# Altium project AMPM_GT1022.PrjPCB
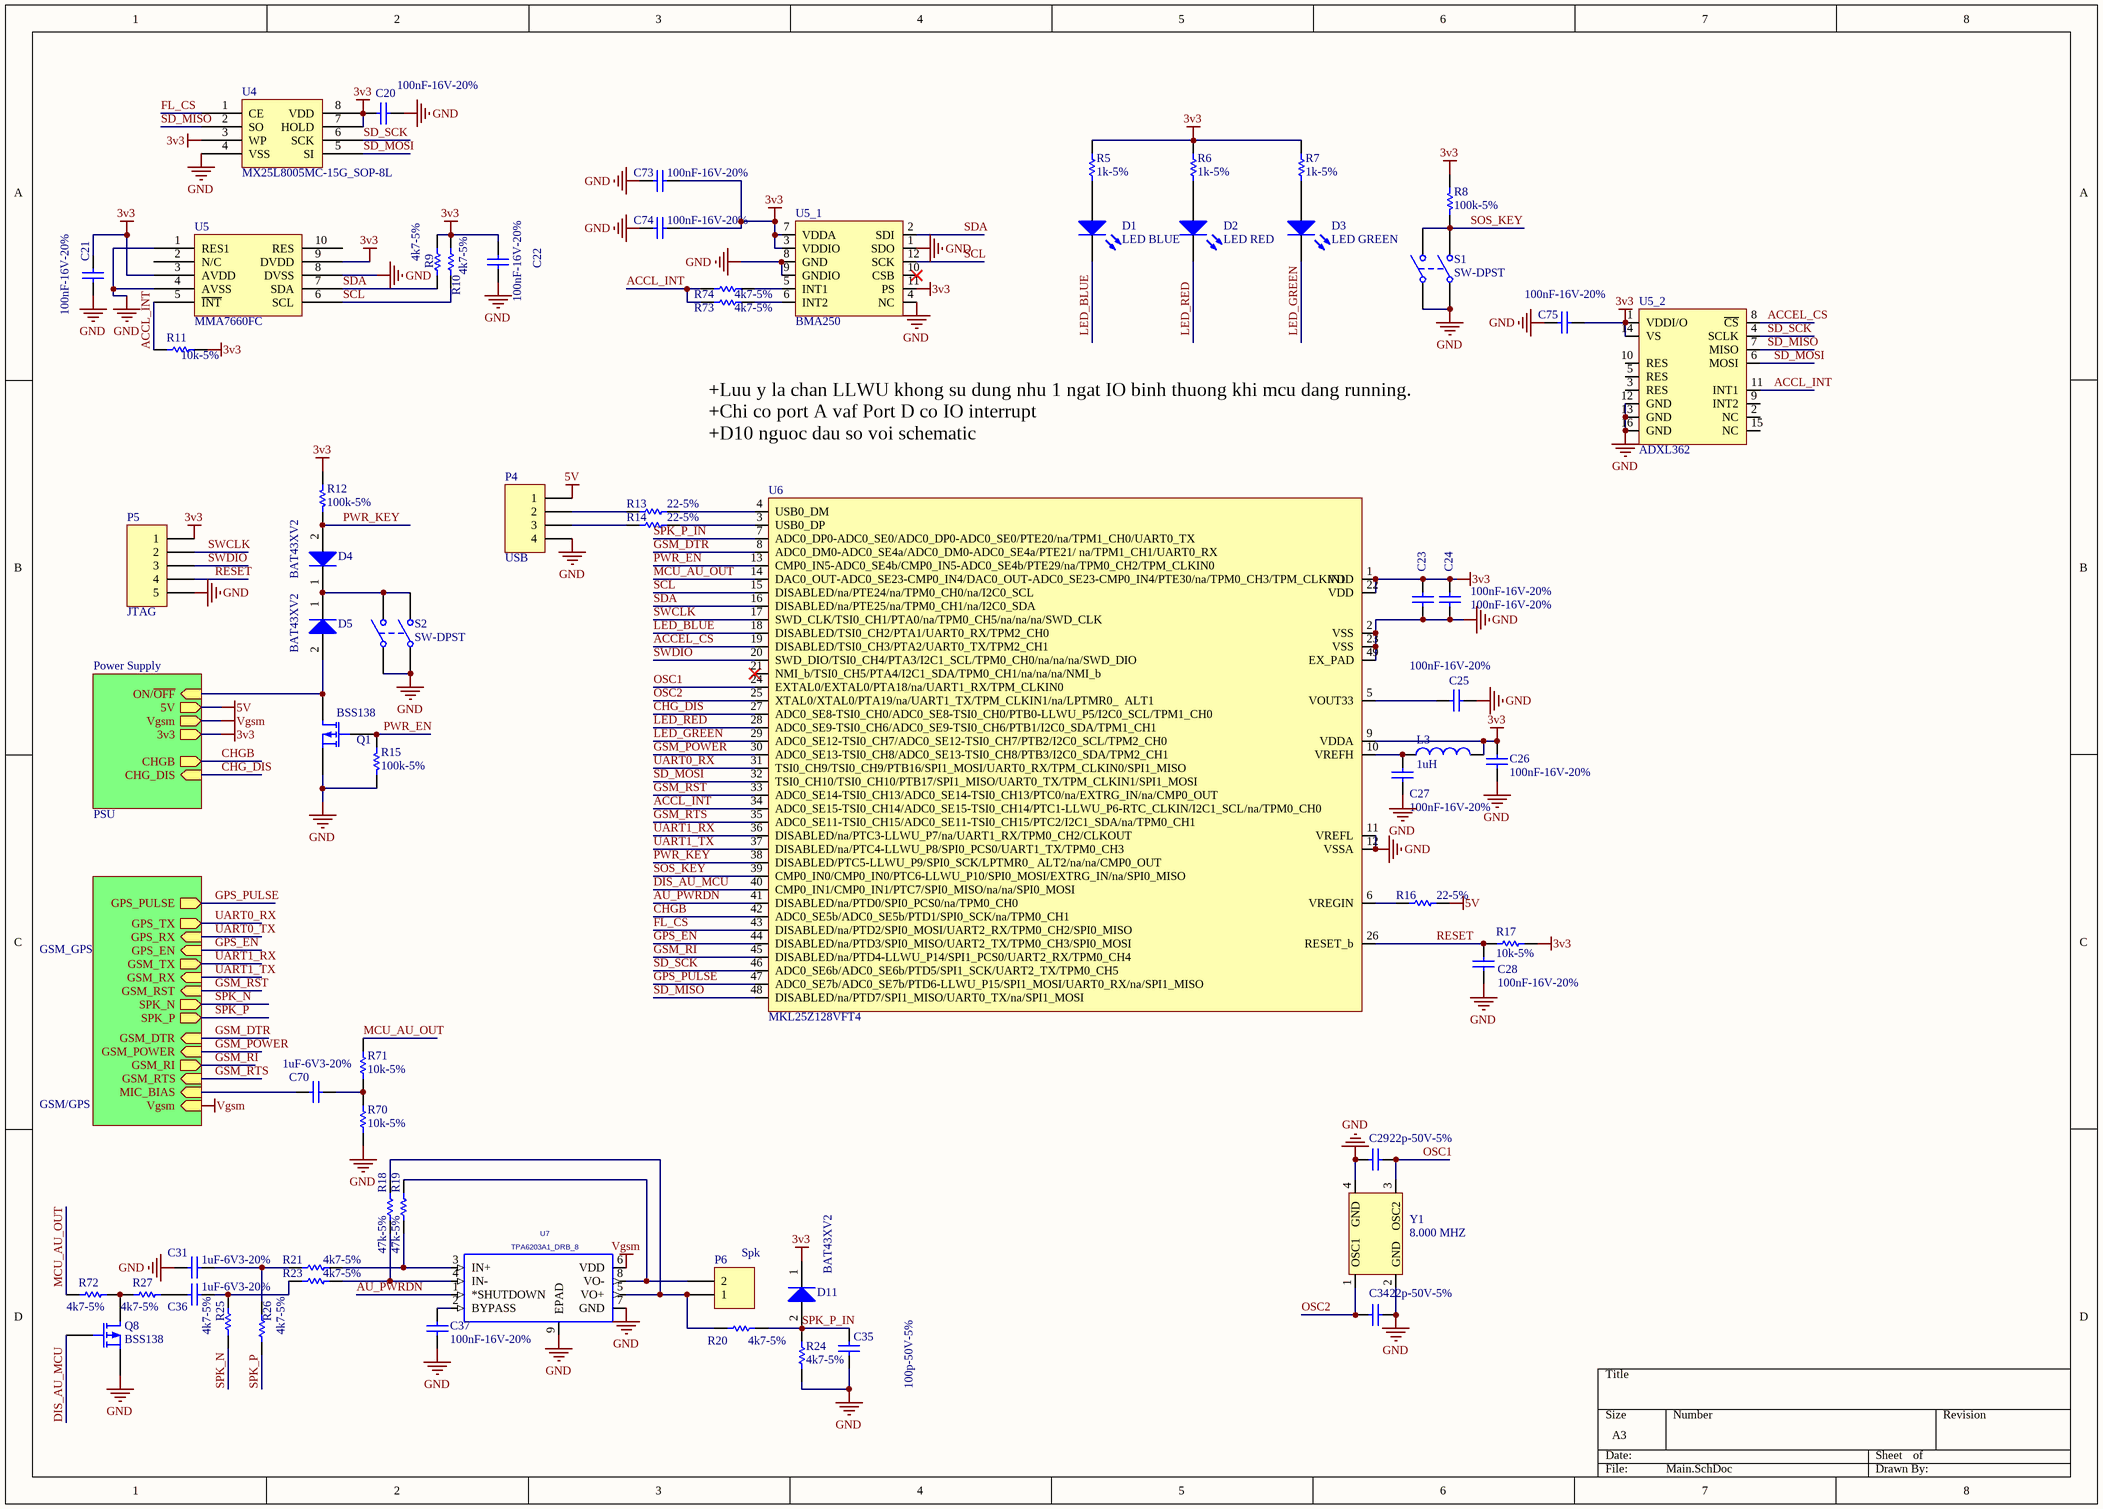
[diagram p0: Main.SchDoc]
3 sheets, 114 parts. Net scope: hierarchical (ports join the sheet entries above them; power ports are global).
Board file: GT1022_V3.PcbDoc
Sheets:
  Main.SchDoc
    Power Supply = PSU.SchDoc
    GSM/GPS = GSM_GPS.SchDoc

## Sheet Main.SchDoc
size A3

### Parts
C20  100nF-16V-20%  [C0402]
C21  100nF-16V-20%  [C0402]
C22  100nF-16V-20%  [C0402]
C23  100nF-16V-20%  [C0402]
C24  100nF-16V-20%  [C0402]
C25  100nF-16V-20%  [C0402]
C26  100nF-16V-20%  [C0402]
C27  100nF-16V-20%  [C0402]
C28  100nF-16V-20%  [C0402]
C29  22p-50V-5%  [C0402]
C31  1uF-6V3-20%  [C0402]
C34  22p-50V-5%  [C0402]
C35  100p-50V-5%  [C0402]
C36  1uF-6V3-20%  [C0402]
C37  100nF-16V-20%  [C0402]
C70  1uF-6V3-20%  [C0402]
C73  100nF-16V-20%  [C0402]
C74  100nF-16V-20%  [C0402]
C75  100nF-16V-20%  [C0402]
D1  LED BLUE  [LED0603-G]
D2  LED RED  [LED0603-G]
D3  LED GREEN  [LED0603-G]
D4  BAT43XV2  [SOD-523F]
D5  BAT43XV2  [SOD-523F]
D11  BAT43XV2  [SOD-523F]
L3  1uH  [L0603]
P4  USB  [GT102x_Housing_USB_nnector]
P5  JTAG  [HEADER_1.27mm_5PIN]
P6  Spk  [SPEAKER-S12A28]
Q1  BSS138  [SOT23-3]
Q8  BSS138  [SOT23-3]
R5  1k-5%  [R0402]
R6  1k-5%  [R0402]
R7  1k-5%  [R0402]
R8  100k-5%  [R0402]
R9  4k7-5%  [R0402]
R10  4k7-5%  [R0402]
R11  10k-5%  [R0402]
R12  100k-5%  [R0402]
R13  22-5%  [R0402]
R14  22-5%  [R0402]
R15  100k-5%  [R0402]
R16  22-5%  [R0402]
R17  10k-5%  [R0402]
R18  47k-5%  [R0402]
R19  47k-5%  [R0402]
R20  4k7-5%  [R0402]
R21  4k7-5%  [R0402]
R23  4k7-5%  [R0402]
R24  4k7-5%  [R0402]
R25  4k7-5%  [R0402]
R26  4k7-5%  [R0402]
R27  4k7-5%  [R0402]
R70  10k-5%  [R0402]
R71  10k-5%  [R0402]
R72  4k7-5%  [R0402]
R73  4k7-5%  [R0402]
R74  4k7-5%  [R0402]
S1  SW-DPST  [BUTTON-TVAF11-025B-R]
S2  SW-DPST  [BUTTON-TVAF11-025B-R]
U4  MX25L8005MC-15G_SOP-8L  [SO8-150mil]
U5  MMA7660FC  [MMA7660FC]
U5_1  BMA250  [BMA250]
U5_2  ADXL362  [ADXL362]
U6  MKL25Z128VFT4
U7  TPA6203A1_DRB_8  [DRB8_1P75X1P5]
Y1  8.000 MHZ  [SMD CRYSTAL 4 x 2.5]

### Sub-sheets
GSM/GPS = GSM_GPS: GSM_POWER (in), GSM_RX (in), GSM_TX (out), Vgsm (in), GPS_RX (in), GPS_TX (out), GSM_RI (out), GPS_EN (in), GSM_RST (in), GSM_RTS (in), SPK_N (out), SPK_P (out), MIC_BIAS (in), GPS_PULSE (out), GSM_DTR (in)
Power Supply = PSU: Vgsm (out), 3v3 (out), 5V (out), ON/~{OFF} (in), CHGB (out), CHG_DIS (in)

### Nets
3v3: C20.1 C21.2 C22.2 C23.1 C24.1 C26.2 C73.2 C74.2 C75.2 D11.1(K) L3.2 P5.1 R5.2 R6.2 R7.2 R8.1 R9.2 R10.2 R11.2 R12.1 R17.2 U4.3(WP) U4.7(HOLD) U4.8(VDD) U5.3(AVDD) U5.9(DVDD) U5_1.3(VDDIO) U5_1.7(VDDA) U5_1.11(PS) U5_2.1(VDDI/O) U5_2.14(VS) U6.1(VDD) U6.9(VDDA) U6.22(VDD) ; sheet Power Supply/3v3
5V: P4.1 R16.2 ; sheet Power Supply/5V
GND: C20.2 C21.1 C22.1 C23.2 C24.2 C25.2 C26.1 C27.1 C28.1 C29.1 C31.2 C34.2 C35.1 C37.1 C73.1 C74.1 C75.1 P4.4 P5.5 Q1.2(S) Q8.2(S) R15.2 R24.2 R70.1 S1.1 S1.2 S2.1 S2.2 U4.4(VSS) U5.1(RES1) U5.4(AVSS) U5.8(DVSS) U5_1.1(SDO) U5_1.4(NC) U5_1.8(GND) U5_1.9(GNDIO) U5_2.12(GND) U5_2.13(GND) U5_2.16(GND) U6.2(VSS) U6.11(VREFL) U6.12(VSSA) U6.23(VSS) U6.49(EX_PAD) U7.7(GND) U7.9(EPAD) Y1.2(GND) Y1.4(GND)
VGSM: U7.6(VDD) ; sheet Power Supply/Vgsm, sheet GSM/GPS/Vgsm
ACCEL_CS: U5_2.8(~{CS}) U6.19(DISABLED/TSI0_CH3/PTA2/UART0_TX/TPM2_CH1)
ACCL_INT: R11.1 R73.2 R74.2 U5.5(~{INT}) U5_2.11(INT1) U6.34(ADC0_SE15-TSI0_CH14/ADC0_SE15-TSI0_CH14/PTC1-LLWU_P6-RTC_CLKIN/I2C1_SCL/na/TPM0_CH0)
AU_PWRDN: U6.41(DISABLED/na/PTD0/SPI0_PCS0/na/TPM0_CH0) U7.1(*SHUTDOWN)
CHG_DIS: U6.27(ADC0_SE8-TSI0_CH0/ADC0_SE8-TSI0_CH0/PTB0-LLWU_P5/I2C0_SCL/TPM1_CH0) ; sheet Power Supply/CHG_DIS
CHGB: U6.42(ADC0_SE5b/ADC0_SE5b/PTD1/SPI0_SCK/na/TPM0_CH1) ; sheet Power Supply/CHGB
DIS_AU_MCU: Q8.1(G) U6.40(CMP0_IN1/CMP0_IN1/PTC7/SPI0_MISO/na/na/SPI0_MOSI)
FL_CS: U4.1(CE) U6.43(DISABLED/na/PTD2/SPI0_MOSI/UART2_RX/TPM0_CH2/SPI0_MISO)
GPS_EN: U6.44(DISABLED/na/PTD3/SPI0_MISO/UART2_TX/TPM0_CH3/SPI0_MOSI) ; sheet GSM/GPS/GPS_EN
GPS_PULSE: U6.47(ADC0_SE7b/ADC0_SE7b/PTD6-LLWU_P15/SPI1_MOSI/UART0_RX/na/SPI1_MISO) ; sheet GSM/GPS/GPS_PULSE
GSM_DTR: U6.8(ADC0_DM0-ADC0_SE4a/ADC0_DM0-ADC0_SE4a/PTE21/_na/TPM1_CH1/UART0_RX) ; sheet GSM/GPS/GSM_DTR
GSM_POWER: U6.30(ADC0_SE13-TSI0_CH8/ADC0_SE13-TSI0_CH8/PTB3/I2C0_SDA/TPM2_CH1) ; sheet GSM/GPS/GSM_POWER
GSM_RI: U6.45(DISABLED/na/PTD4-LLWU_P14/SPI1_PCS0/UART2_RX/TPM0_CH4) ; sheet GSM/GPS/GSM_RI
GSM_RST: U6.33(ADC0_SE14-TSI0_CH13/ADC0_SE14-TSI0_CH13/PTC0/na/EXTRG_IN/na/CMP0_OUT) ; sheet GSM/GPS/GSM_RST
GSM_RTS: U6.35(ADC0_SE11-TSI0_CH15/ADC0_SE11-TSI0_CH15/PTC2/I2C1_SDA/na/TPM0_CH1) ; sheet GSM/GPS/GSM_RTS
LED_BLUE: D1.2(K) U6.18(DISABLED/TSI0_CH2/PTA1/UART0_RX/TPM2_CH0)
LED_GREEN: D3.2(K) U6.29(ADC0_SE12-TSI0_CH7/ADC0_SE12-TSI0_CH7/PTB2/I2C0_SCL/TPM2_CH0)
LED_RED: D2.2(K) U6.28(ADC0_SE9-TSI0_CH6/ADC0_SE9-TSI0_CH6/PTB1/I2C0_SDA/TPM1_CH1)
MCU_AU_OUT: R71.2 R72.1 U6.14(DAC0_OUT-ADC0_SE23-CMP0_IN4/DAC0_OUT-ADC0_SE23-CMP0_IN4/PTE30/na/TPM0_CH3/TPM_CLKIN1)
MIC_BIAS: C70.2 ; sheet GSM/GPS/MIC_BIAS
OSC1: C29.2 U6.24(EXTAL0/EXTAL0/PTA18/na/UART1_RX/TPM_CLKIN0) Y1.3(OSC2)
OSC2: C34.1 U6.25(XTAL0/XTAL0/PTA19/na/UART1_TX/TPM_CLKIN1/na/LPTMR0___ALT1) Y1.1(OSC1)
PWR_EN: Q1.1(G) R15.1 U6.13(CMP0_IN5-ADC0_SE4b/CMP0_IN5-ADC0_SE4b/PTE29/na/TPM0_CH2/TPM_CLKIN0)
PWR_KEY: D4.2(A) R12.2 U6.38(DISABLED/PTC5-LLWU_P9/SPI0_SCK/LPTMR0__ALT2/na/na/CMP0_OUT)
RESET: C28.2 P5.4 R17.1 U6.26(RESET_b)
SCL: R10.1 U5.6(SCL) U5_1.12(SCK) U6.15(DISABLED/na/PTE24/na/TPM0_CH0/na/I2C0_SCL)
SD_MISO: U4.2(SO) U5_2.7(MISO) U6.48(DISABLED/na/PTD7/SPI1_MISO/UART0_TX/na/SPI1_MOSI)
SD_MOSI: U4.5(SI) U5_2.6(MOSI) U6.32(TSI0_CH10/TSI0_CH10/PTB17/SPI1_MISO/UART0_TX/TPM_CLKIN1/SPI1_MOSI)
SD_SCK: U4.6(SCK) U5_2.4(SCLK) U6.46(ADC0_SE6b/ADC0_SE6b/PTD5/SPI1_SCK/UART2_TX/TPM0_CH5)
SDA: R9.1 U5.7(SDA) U5_1.2(SDI) U6.16(DISABLED/na/PTE25/na/TPM0_CH1/na/I2C0_SDA)
SOS_KEY: R8.2 S1.3 S1.4 U6.39(CMP0_IN0/CMP0_IN0/PTC6-LLWU_P10/SPI0_MOSI/EXTRG_IN/na/SPI0_MISO)
SPK_N: R25.2 ; sheet GSM/GPS/SPK_N
SPK_P: R26.2 ; sheet GSM/GPS/SPK_P
SPK_P_IN: C35.2 D11.2(A) R20.1 R24.1 U6.7(ADC0_DP0-ADC0_SE0/ADC0_DP0-ADC0_SE0/PTE20/na/TPM1_CH0/UART0_TX)
SWCLK: P5.2 U6.17(SWD_CLK/TSI0_CH1/PTA0/na/TPM0_CH5/na/na/na/SWD_CLK)
SWDIO: P5.3 U6.20(SWD_DIO/TSI0_CH4/PTA3/I2C1_SCL/TPM0_CH0/na/na/na/SWD_DIO)
UART0_RX: U6.31(TSI0_CH9/TSI0_CH9/PTB16/SPI1_MOSI/UART0_RX/TPM_CLKIN0/SPI1_MISO) ; sheet GSM/GPS/GPS_TX  [project net GPS_TXD]
UART1_RX: U6.36(DISABLED/na/PTC3-LLWU_P7/na/UART1_RX/TPM0_CH2/CLKOUT) ; sheet GSM/GPS/GSM_TX
UART1_TX: U6.37(DISABLED/na/PTC4-LLWU_P8/SPI0_PCS0/UART1_TX/TPM0_CH3) ; sheet GSM/GPS/GSM_RX
NetC25_1: C25.1 U6.5(VOUT33)
NetC27_2: C27.2 L3.1 U6.10(VREFH)
NetC31_1: C31.1 R21.2 R26.1
NetC36_1: C36.1 R23.2 R25.1
NetC36_2: C36.2 R27.2
NetC37_2: C37.2 U7.2(BYPASS)
NetC70_1: C70.1 R70.2 R71.1
NetD1_1: D1.1(A) R5.1
NetD2_1: D2.1(A) R6.1
NetD3_1: D3.1(A) R7.1
NetD4_1: D4.1(K) D5.1(K) S2.3 S2.4
NetD5_2: D5.2(A) Q1.3(D) ; sheet Power Supply/ON/~{OFF}
NetP4_2: P4.2 R13.1
NetP4_3: P4.3 R14.1
NetP6_1: P6.1 R18.1 R20.2 U7.5(VO+)
NetP6_2: P6.2 R19.1 U7.8(VO-)
NetQ8_3: Q8.3(D) R27.1 R72.2
NetR13_2: R13.2 U6.4(USB0_DM)
NetR14_2: R14.2 U6.3(USB0_DP)
NetR16_1: R16.1 U6.6(VREGIN)
NetR18_2: R18.2 R23.1 U7.4(IN-)
NetR19_2: R19.2 R21.1 U7.3(IN+)
NetR73_1: R73.1 U5_1.6(INT2)
NetR74_1: R74.1 U5_1.5(INT1)

Not connected (* = marked no-connect by the designer): U5 2(N/C) 10(RES); U5_1 10(CSB)*; U5_2 2(NC) 3(RES) 5(RES) 9(INT2) 10(RES) 15(NC); U6 21(NMI_b/TSI0_CH5/PTA4/I2C1_SDA/TPM0_CH1/na/na/na/NMI_b)*

### Notes on the sheet
- +Luu y la chan LLWU khong su dung nhu 1 ngat IO binh thuong khi mcu dang running.
  +Chi co port A vaf Port D co IO interrupt
  +D10 nguoc dau so voi schematic

### Library data of the parts
C20-C28 C37 C73-C75 = Cap: CAP CER 0.1UF 16V Y5V 0402; Manufacturer: Yageo; Manufacturer Part Number: CC0402ZRY5V7BB104; Published: 8-Jun-2000; LatestRevisionDate: 17-Jul-2002; LatestRevisionNote: Re-released for DXP Platform.; PackageReference: C0402; Publisher: Altium Limited; Value: 100nF-16V-20%; Digi-Key Part Number: 311-1047-1-ND; Unit Price: 0.00250
C29 C34 = Cap: CAP CER 22PF 50V 5% NPO 0402; Manufacturer: Yageo; Manufacturer Part Number: CC0402JRNPO9BN220; Description: CAP CER 15PF 50V 5% NPO 0402; Published: 8-Jun-2000; LatestRevisionDate: 17-Jul-2002; LatestRevisionNote: Re-released for DXP Platform.; PackageReference: C0402; Publisher: Altium Limited; Value: 22p-50V-5%; Digi-Key Part Number: 311-1018-2-ND; Unit Price: 0.00270
C31 C36 C70 = Cap: CAP CER 1UF 6.3V Y5V 0402; Manufacturer: Yageo; Manufacturer Part Number: CC0402ZRY5V5BB105; Published: 8-Jun-2000; LatestRevisionDate: 17-Jul-2002; LatestRevisionNote: Re-released for DXP Platform.; PackageReference: C0402; Publisher: Altium Limited; Value: 1uF-6V3-20%; Digi-Key Part Number: 311-1377-2-ND; Unit Price: 0.00465
C35 = Cap: CAP CER 100PF 50V 5% NPO 0402; Manufacturer: Yageo; Manufacturer Part Number: CC0402JRNPO9BN101; Description: CAP CER 47PF 50V 5% NPO 0402; Published: 8-Jun-2000; LatestRevisionDate: 17-Jul-2002; LatestRevisionNote: Re-released for DXP Platform.; PackageReference: C0603; Publisher: Altium Limited; Value: 100p-50V-5%; Digi-Key Part Number: 311-1024-2-ND; Unit Price: 0.00270
D1 = LED2: LED BLUE CLEAR THIN 0603 SMD; Manufacturer: Lite-On Inc; Manufacturer Part Number: LTST-C191KGKT; Published: 8-Jun-2000; LatestRevisionDate: 17-Jul-2002; LatestRevisionNote: Re-released for DXP Platform.; PackageVersion: Feb-2002; PackageReference: 3.2X1.6X1.1; Publisher: Altium Limited; Digi-Key Part Number: 160-1446-2-ND; Unit Price: 0.03780; Value: LED BLUE
D2 = LED2: LED RED CLEAR THIN 0603 SMD; Manufacturer: Lite-On Inc; Manufacturer Part Number: LTST-C191KGKT; Published: 8-Jun-2000; LatestRevisionDate: 17-Jul-2002; LatestRevisionNote: Re-released for DXP Platform.; PackageVersion: Feb-2002; PackageReference: 3.2X1.6X1.1; Publisher: Altium Limited; Digi-Key Part Number: 160-1446-2-ND; Unit Price: 0.03780; Value: LED RED
D3 = LED2: LED GREEN CLEAR THIN 0603 SMD; Manufacturer: Lite-On Inc; Manufacturer Part Number: LTST-C191KGKT; Published: 8-Jun-2000; LatestRevisionDate: 17-Jul-2002; LatestRevisionNote: Re-released for DXP Platform.; PackageVersion: Feb-2002; PackageReference: 3.2X1.6X1.1; Publisher: Altium Limited; Digi-Key Part Number: 160-1446-2-ND; Unit Price: 0.03780; Value: LED GREEN
D4 D5 D11 = Diode: Diode Type SMD; Manufacturer: Fairchild Semiconductor; Published: 8-Jun-2000; LatestRevisionDate: 17-Jul-2002; LatestRevisionNote: Re-released for DXP Platform.; PackageVersion: Sep-1996; PackageReference: SMC; Publisher: Altium Limited; Code_JEDEC: DO-214-AB; Value: BAT43XV2; Digi-Key Part Number: BAT43XV2CT-ND; Manufacturer Part Number: BAT43XV2; Unit Price: 0.01822
L3 = Inductor: INDUCTOR 1.0UH 150MA 0603; Manufacturer: Murata Electronics North America; Manufacturer Part Number: LQM18FN1R0M00D; Code_IEC: 1005; Published: 8-Jun-2000; LatestRevisionDate: 29-May-2009; LatestRevisionNote: IPC-7351 Footprint Added.; PackageReference: 0402-A; Publisher: Altium Limited; PackageDescription: Chip Inductor; Code_JEITA: 0402; Value: 1uH; Digi-Key Part Number: 490-4022-2-ND; Unit Price: 0.03756
P4 = Header 4: Header, 4-Pin; LatestRevisionDate: 17-Jul-2002; LatestRevisionNote: Re-released for DXP Platform.; Publisher: Altium Limited
P5 = Header 5: Header, 5-Pin; LatestRevisionDate: 17-Jul-2002; LatestRevisionNote: Re-released for DXP Platform.; Publisher: Altium Limited
P6 = Header 2: Header, 2-Pin; LatestRevisionDate: 17-Jul-2002; LatestRevisionNote: Re-released for DXP Platform.; Publisher: Altium Limited
Q1 Q8 = MOSFET-P: MOSFET N-CH 50V 200MA SOT23-3; Manufacturer: Diodes Inc; Manufacturer Part Number: BSS138-7-F; Published: 8-Jun-2000; LatestRevisionDate: 17-Jul-2002; LatestRevisionNote: Re-released for DXP Platform.; PackageVersion: 1995/1996; PackageReference: E3; Publisher: Altium Limited; Digi-Key Part Number: BSS138-FDICT-ND; Unit Price: 0.06575
R5-R7 = Res1: RES 1.0K OHM 1/16W 5% 0402 SMD; Manufacturer: Yageo; Manufacturer Part Number: RC0402JR-071KL; Published: 8-Jun-2000; LatestRevisionDate: 17-Jul-2002; LatestRevisionNote: Re-released for DXP Platform.; PackageReference: R0603; Publisher: Altium Limited; Value: 1k-5%; Digi-Key Part Number: 311-1.0KJRCT-ND; Unit Price: 0.00178
R8 R12 R15 = Res1: RES 100K OHM 1/16W 5% 0402 SMD; Manufacturer: Yageo; Manufacturer Part Number: RC0402JR-07100KL; Published: 8-Jun-2000; LatestRevisionDate: 17-Jul-2002; LatestRevisionNote: Re-released for DXP Platform.; PackageReference: R0402; Publisher: Altium Limited; Value: 100k-5%; Digi-Key Part Number: 311-100KJRCT-ND; Unit Price: 0.00171
R9 R10 R20 R21 R23-R27 R72-R74 = Res1: RES 4.7K OHM 1/16W 5% 0402 SMD; Manufacturer: Yageo; Manufacturer Part Number: RC0402JR-074K7L; Description: RES 10K OHM 1/10W 5% 0603 SMD; Published: 8-Jun-2000; LatestRevisionDate: 17-Jul-2002; LatestRevisionNote: Re-released for DXP Platform.; PackageReference: R0603; Publisher: Altium Limited; Value: 4k7-5%; Digi-Key Part Number: 311-4.7KJRCT-ND; Unit Price: 0.00178
R11 R17 R70 R71 = Res1: RES 10K OHM 1/16W 5% 0402 SMD; Manufacturer: Yageo; Manufacturer Part Number: RC0402JR-0710KL; Description: RES 10K OHM 1/10W 5% 0603 SMD; Published: 8-Jun-2000; LatestRevisionDate: 17-Jul-2002; LatestRevisionNote: Re-released for DXP Platform.; PackageReference: R0603; Publisher: Altium Limited; Value: 10k-5%; Digi-Key Part Number: 311-10KJRCT-ND; Unit Price: 0.00178
R13 R14 R16 = Res1: RES 22 OHM 1/16W 5% 0402 SMD; Manufacturer: Yageo; Manufacturer Part Number: RC0402JR-0722RL; Published: 8-Jun-2000; LatestRevisionDate: 17-Jul-2002; LatestRevisionNote: Re-released for DXP Platform.; PackageReference: R0402; Publisher: Altium Limited; Value: 22-5%; Digi-Key Part Number: 311-22JRCT-ND; Unit Price: 0.00178
R18 R19 = Res1: RES 47K OHM 1/16W 5% 0402 SMD; Manufacturer: Yageo; Manufacturer Part Number: RC0402JR-0747KL; Published: 8-Jun-2000; LatestRevisionDate: 17-Jul-2002; LatestRevisionNote: Re-released for DXP Platform.; PackageReference: R0603; Publisher: Altium Limited; Value: 47k-5%; Digi-Key Part Number: 311-47KJRCT-ND; Unit Price: 0.00178
S1 S2 = SW-DPST: Double-Pole, Single-Throw Switch; Published: 24-Mar-1999; LatestRevisionDate: 17-Jul-2002; LatestRevisionNote: Re-released for DXP Platform.; PackageReference: DPST-4; Publisher: Altium Limited
U4 = FlashIC: Manufacturer: Tyrone
U5 = MMA7660FC: ACCELEROMETER 3X3 DGTL 10-DFN; Manufacturer: Freescale Semiconductor; Manufacturer Part Number: MMA7660FCT; Unit Price: 0.67000; Digi-Key Part Number: MMA7660FCT-ND
U5_1 = BMA250: 3-AXIS ACCELEROMETER DIGITAL I/F
U5_2 = ADCL362: IC ACCEL DIG LO PWR 3AX 16LGA; Manufacturer Part Number: ADXL362BCCZ-RL7; Manufacturer: Analog Devices Inc; Digi-Key Part Number: ADXL362BCCZ-R2CT-ND; Unit Price: 4.76400; Value: ADXL362
U6 = MKL25Z128VFT4: IC ARM CORTEX MCU 128KB 48QFN; Manufacturer: Freescale Semiconductor; Digi-Key Part Number: MKL25Z128VFT4-ND; Manufacturer Part Number: MKL25Z128VFT4; Unit Price: 2.14920
U7 = TPA6203A1_DRB_8: IC AMP AUDIO PWR 1.25W MONO 8SON; Manufacturer Part Number: TPA6203A1DRB; Vendor: Texas Instruments; PACKAGE_DESIGNATOR: DRB; PIN_COUNT: 8; FAMILY_NAME: DYNAMIC SPEAKER; INDUSTRY_STD_PKG_TYPE: SON; Value: TPA6203A1_DRB_8; GENERIC_PART_NUMBER: TPA6203A1; Datasheet URL: http://www.ti.com/lit/gpn/TPA6203A1; Manufacturer: Texas Instruments; Digi-Key Part Number: 296-34561-5-ND; Unit Price: 0.37248
Y1 = CRYSTAL-SMT: CRYSTAL 8.000 MHZ 18PF SMD; Manufacturer: TXC CORPORATION; Manufacturer Part Number: 7B-8.000MAAJ-T; Digi-Key Part Number: 887-1452-2-ND; Unit Price: 0.39000; Value: 8.000 MHZ

## Sheet PSU.SchDoc
size A4
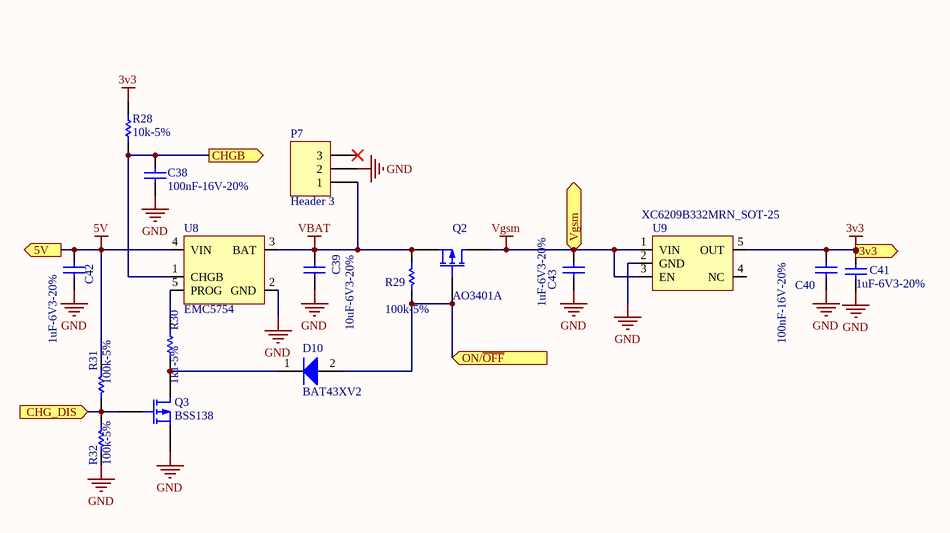
[diagram p1: PSU.SchDoc]

### Parts
C38  100nF-16V-20%  [C0402]
C39  10uF-6V3-20%  [C0402]
C40  100nF-16V-20%  [C0402]
C41  1uF-6V3-20%  [C0402]
C42  1uF-6V3-20%  [C0402]
C43  1uF-6V3-20%  [C0402]
D10  BAT43XV2  [SOD-523F]
P7  Header 3  [BAT_CON]
Q2  AO3401A  [SOT23-3]
Q3  BSS138  [SOT23-3]
R28  10k-5%  [R0402]
R29  100k-5%  [R0402]
R30  1k1-5%  [R0402]
R31  100k-5%  [R0402]
R32  100k-5%  [R0402]
U8  EMC5754  [SOT23-5]
U9  XC6209B332MRN_SOT-25  [SOT23-5]

### Ports
3v3 (out), 5V (out), CHG_DIS (in), CHGB (out), ON/~{OFF} (in), Vgsm (out)

### Nets
3v3: C40.2 C41.1 R28.2 U9.5(OUT) ; port 3v3
5V: C42.2 R31.2 U8.4(VIN) ; port 5V
GND: C38.1 C39.1 C40.1 C41.2 C42.1 C43.2 P7.2 Q3.2(S) R32.1 U8.2(GND) U9.2(GND)
VBAT: C39.2 P7.1 Q2.2(S) R29.2 U8.3(BAT)
VGSM: C43.1 Q2.3(D) U9.1(VIN) U9.3(EN) ; port Vgsm
CHG_DIS: Q3.1(G) R31.1 R32.2 ; port CHG_DIS
CHGB: C38.2 R28.1 U8.1(CHGB) ; port CHGB
NetD5_2: D10.2(A) Q2.1(G) R29.1 ; port ON/~{OFF}
NetD10_1: D10.1(K) Q3.3(D) R30.2
NetR30_1: R30.1 U8.5(PROG)

Not connected (* = marked no-connect by the designer): P7 3*; U9 4(NC)

### Library data of the parts
C38 C40 = Cap: as C20 on sheet Main; Published: 8-Jun-2000; LatestRevisionDate: 17-Jul-2002; LatestRevisionNote: Re-released for DXP Platform.; PackageReference: C0402; Publisher: Altium Limited; Value: 100nF-16V-20%; Digi-Key Part Number: 311-1047-1-ND; Unit Price: 0.00250
C39 = Cap: CAP CER 10UF 6.3V 20% X5R 0603; Manufacturer: Yageo; Manufacturer Part Number: CC0603MRX5R5BB106; Published: 8-Jun-2000; LatestRevisionDate: 17-Jul-2002; LatestRevisionNote: Re-released for DXP Platform.; PackageReference: C0603; Publisher: Altium Limited; Value: 10uF-6V3-20%; Digi-Key Part Number: 311-1448-1-ND; Unit Price: 0.06176
C41-C43 = Cap: as C31 on sheet Main; Published: 8-Jun-2000; LatestRevisionDate: 17-Jul-2002; LatestRevisionNote: Re-released for DXP Platform.; PackageReference: C0402; Publisher: Altium Limited; Value: 1uF-6V3-20%; Digi-Key Part Number: 311-1377-2-ND; Unit Price: 0.00465
D10 = Diode: as D4 on sheet Main; Published: 8-Jun-2000; LatestRevisionDate: 17-Jul-2002; LatestRevisionNote: Re-released for DXP Platform.; PackageVersion: Sep-1996; PackageReference: SMC; Publisher: Altium Limited; Code_JEDEC: DO-214-AB; Value: BAT43XV2; Digi-Key Part Number: BAT43XV2CT-ND; Manufacturer Part Number: BAT43XV2; Unit Price: 0.01822
P7 = Header 3: Header, 3-Pin; LatestRevisionDate: 17-Jul-2002; LatestRevisionNote: Re-released for DXP Platform.; Publisher: Altium Limited
Q2 = MOSFET-P: MOSFET P-CH -30V -4.3A SOT23; Manufacturer: Alpha & Omega Semiconductor Inc; Remark: NA; Published: 8-Jun-2000; LatestRevisionDate: 17-Jul-2002; LatestRevisionNote: Re-released for DXP Platform.; PackageVersion: 1995/1996; PackageReference: E3; Publisher: Altium Limited; Digi-Key Part Number: 785-1001-1-ND; Manufacturer Part Number: AO3401A; Unit Price: 0.12400
Q3 = MOSFET-P: as Q1 on sheet Main; Published: 8-Jun-2000; LatestRevisionDate: 17-Jul-2002; LatestRevisionNote: Re-released for DXP Platform.; PackageVersion: 1995/1996; PackageReference: E3; Publisher: Altium Limited; Digi-Key Part Number: BSS138-FDICT-ND; Unit Price: 0.06575
R28 = Res1: as R11 on sheet Main; Published: 8-Jun-2000; LatestRevisionDate: 17-Jul-2002; LatestRevisionNote: Re-released for DXP Platform.; PackageReference: R0603; Publisher: Altium Limited; Value: 10k-5%; Digi-Key Part Number: 311-10KJRCT-ND; Unit Price: 0.00178
R29 R31 R32 = Res1: as R8 on sheet Main; Published: 8-Jun-2000; LatestRevisionDate: 17-Jul-2002; LatestRevisionNote: Re-released for DXP Platform.; PackageReference: R0402; Publisher: Altium Limited; Value: 100k-5%; Digi-Key Part Number: 311-100KJRCT-ND; Unit Price: 0.00171
R30 = Res1: RES 1.1K OHM 1/16W 5% 0402 SMD; Manufacturer: Yageo; Manufacturer Part Number: RC0402JR-071K1L; Published: 8-Jun-2000; LatestRevisionDate: 17-Jul-2002; LatestRevisionNote: Re-released for DXP Platform.; PackageReference: R0603; Publisher: Altium Limited; Value: 1k1-5%; Digi-Key Part Number: 311-1.1KJRCT-ND; Unit Price: 0.00207
U9 = XC6209B332MRN_SOT-25: Manufacturer: Tyrone

## Sheet GSM_GPS.SchDoc
size A4
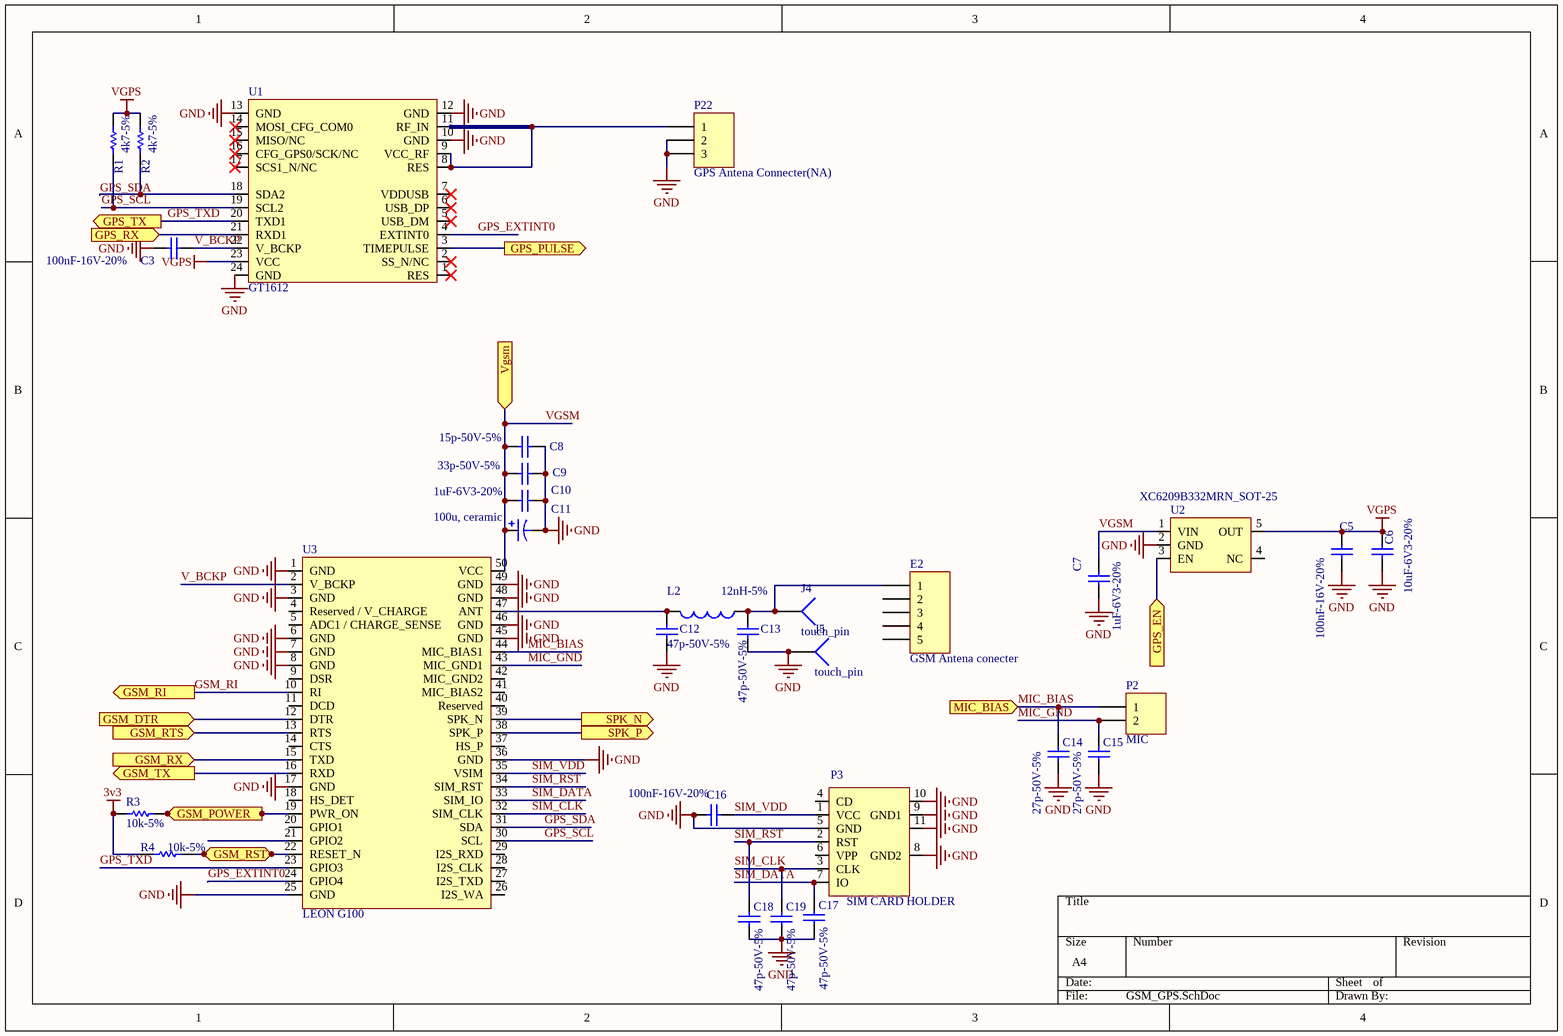
[diagram p2: GSM_GPS.SchDoc]

### Parts
C3  100nF-16V-20%  [C0402]
C5  100nF-16V-20%  [C0402]
C6  10uF-6V3-20%  [C0603]
C7  1uF-6V3-20%  [C0402]
C8  15p-50V-5%  [C0402]
C9  33p-50V-5%  [C0402]
C10  1uF-6V3-20%  [C0402]
C11  100u, ceramic  [C1210]
C12  47p-50V-5%  [C0402]
C13  47p-50V-5%  [C0402]
C14  27p-50V-5%  [C0402]
C15  27p-50V-5%  [C0402]
C16  100nF-16V-20%  [C0402]
C17  47p-50V-5%  [C0402]
C18  47p-50V-5%  [C0402]
C19  47p-50V-5%  [C0402]
E2  GSM Antena conecter  [A10343-GSM850/900/1800/1900/WCDMA]
J4  touch_pin  [TOUCH_PIN]
J5  touch_pin  [TOUCH_PIN]
L2  12nH-5%  [R0402]
P2  MIC  [HEADER_1.27mm_2PIN]
P3  SIM CARD HOLDER  [MICRO_SIM_SOCKET]
P22  GPS Antena Connecter(NA)  [IPX SMD PCB Plug]
R1  4k7-5%  [R0402]
R2  4k7-5%  [R0402]
R3  10k-5%  [R0402]
R4  10k-5%  [R0402]
U1  GT1612  [GT1612]
U2  XC6209B332MRN_SOT-25  [SOT23-5]
U3  LEON G100  [U-BLOX-G100]

### Ports
GPS_EN (in), GPS_PULSE (out), GPS_RX (in), GPS_TX (out), GSM_DTR (in), GSM_POWER (in), GSM_RI (out), GSM_RST (in), GSM_RTS (in), GSM_RX (in), GSM_TX (out), MIC_BIAS (in), SPK_N (out), SPK_P (out), Vgsm (in)

### Nets
3v3: R3.1 R4.1
GND: C3.1 C5.1 C6.1 C7.1 C8.2 C9.2 C10.1 C11.2 C12.1 C13.1 C14.1 C15.1 C16.2 C17.1 C18.1 C19.1 J5.1 P3.5(GND) P3.8(GND2) P3.9(GND1) P3.10(GND3) P3.11(GND4) P22.2 P22.3 U1.10(GND) U1.12(GND) U1.13(GND) U1.24(GND) U2.2(GND) U3.1(GND) U3.3(GND) U3.6(GND) U3.7(GND) U3.8(GND) U3.17(GND) U3.25(GND) U3.36(GND) U3.45(GND) U3.46(GND) U3.48(GND) U3.49(GND)
VGPS: C5.2 C6.2 R1.2 R2.2 U1.23(VCC) U2.5(OUT)
VGSM: C7.2 C8.1 C9.1 C10.2 C11.1 U2.1(VIN) U3.50(VCC) ; port Vgsm
GPS_EN: U2.3(EN) ; port GPS_EN
GPS_EXTINT0: U1.4(EXTINT0) U3.24(GPIO4)
GPS_PULSE: U1.3(TIMEPULSE) ; port GPS_PULSE
GPS_SCL: R1.1 U1.19(SCL2) U3.30(SCL)
GPS_SDA: R2.1 U1.18(SDA2) U3.31(SDA)
GPS_TXD: U1.20(TXD1) U3.23(GPIO3) ; port GPS_TX
GSM_DTR: U3.12(DTR) ; port GSM_DTR
GSM_POWER: R3.2 U3.19(PWR_ON) ; port GSM_POWER
GSM_RI: U3.10(RI) ; port GSM_RI
GSM_RST: R4.2 U3.22(RESET_N) ; port GSM_RST
GSM_RTS: U3.13(RTS) ; port GSM_RTS
MIC_BIAS: C14.2 P2.1 U3.44(MIC_BIAS1) ; port MIC_BIAS
MIC_GND: C15.2 P2.2 U3.43(MIC_GND1)
SIM_CLK: C19.2 P3.3(CLK) U3.32(SIM_CLK)
SIM_DATA: C17.2 P3.7(IO) U3.33(SIM_IO)
SIM_RST: C18.2 P3.2(RST) U3.34(SIM_RST)
SIM_VDD: C16.1 P3.1(VCC) U3.35(VSIM)
SPK_N: U3.39(SPK_N) ; port SPK_N
SPK_P: U3.38(SPK_P) ; port SPK_P
UART0_TX: U1.21(RXD1) ; port GPS_RX
UART1_RX: U3.16(RXD) ; port GSM_TX
UART1_TX: U3.15(TXD) ; port GSM_RX
V_BCKP: C3.2 U1.22(V_BCKP) U3.2(V_BCKP)
NetC12_2: C12.2 L2.2 U3.47(ANT)
NetC13_2: C13.2 E2.1 J4.1 L2.1
NetP22_1: P22.1 U1.8(RES) U1.9(VCC_RF) U1.11(RF_IN)

Not connected (* = marked no-connect by the designer): E2 2 3 4 5; P3 4(CD) 6(VPP); U1 1(RES)* 2(SS_N/NC)* 5(USB_DM)* 6(USB_DP)* 7(VDDUSB)* 14(MOSI_CFG_COM0)* 15(MISO/NC)* 16(CFG_GPS0/SCK/NC)* 17(SCS1_N/NC)*; U2 4(NC); U3 4(Reserved_/_V_CHARGE) 5(ADC1_/_CHARGE_SENSE) 9(DSR) 11(DCD) 14(CTS) 18(HS_DET) 20(GPIO1) 21(GPIO2) 26(I2S_WA) 27(I2S_TXD) 28(I2S_CLK) 29(I2S_RXD) 37(HS_P) 40(Reserved) 41(MIC_BIAS2) 42(MIC_GND2)

### Library data of the parts
C3 C5 C16 = Cap: as C20 on sheet Main; Published: 8-Jun-2000; LatestRevisionDate: 17-Jul-2002; LatestRevisionNote: Re-released for DXP Platform.; PackageReference: C0402; Publisher: Altium Limited; Value: 100nF-16V-20%; Digi-Key Part Number: 311-1047-1-ND; Unit Price: 0.00250
C6 = Cap: CAP CER 10UF 6.3V 20% X5R 0603; Manufacturer: Murata Electronics North America; Manufacturer Part Number: GRM188R60J106ME47D; Published: 8-Jun-2000; LatestRevisionDate: 17-Jul-2002; LatestRevisionNote: Re-released for DXP Platform.; PackageReference: C0603; Publisher: Altium Limited; Value: 10uF-6V3-20%; Digi-Key Part Number: 490-3896-1-ND; Unit Price: 0.07873
C7 C10 = Cap: as C31 on sheet Main; Published: 8-Jun-2000; LatestRevisionDate: 17-Jul-2002; LatestRevisionNote: Re-released for DXP Platform.; PackageReference: C0402; Publisher: Altium Limited; Value: 1uF-6V3-20%; Digi-Key Part Number: 311-1377-2-ND; Unit Price: 0.00465
C8 = Cap: CAP CER 15PF 50V 5% NPO 0402; Manufacturer: Yageo; Manufacturer Part Number: CC0402JRNPO9BN150; Published: 8-Jun-2000; LatestRevisionDate: 17-Jul-2002; LatestRevisionNote: Re-released for DXP Platform.; PackageReference: C0402; Publisher: Altium Limited; Value: 15p-50V-5%; Digi-Key Part Number: 311-1017-1-ND; Unit Price: 0.00270
C9 = Cap: CAP CER 33PF 50V 5% NPO 0402; Manufacturer: Yageo; Manufacturer Part Number: CC0402JRNPO9BN330; Published: 8-Jun-2000; LatestRevisionDate: 17-Jul-2002; LatestRevisionNote: Re-released for DXP Platform.; PackageReference: C0603; Publisher: Altium Limited; Value: 33p-50V-5%; Digi-Key Part Number: 311-1020-1-ND; Unit Price: 0.00270
C11 = Cap Pol3: CAP CER 100UF 10V 20% X5R 1812; Manufacturer Part Number: C4532X5R1A107M; Manufacturer: TDK Corporation; Published: 8-Jun-2000; LatestRevisionDate: 29-May-2009; LatestRevisionNote: IPC-7351 Footprint Added.; PackageReference: C0805; Publisher: Altium Limited; PackageDescription: Chip Capacitor; Digi-Key Part Number: 445-7743-2-ND; Unit Price: 0.55800
C12 C13 = Cap: CAP CER 47PF 50V 5% NPO 0402; Manufacturer: Yageo; Manufacturer Part Number: CC0402JRNPO9BN470; Remark: NA; Published: 8-Jun-2000; LatestRevisionDate: 17-Jul-2002; LatestRevisionNote: Re-released for DXP Platform.; PackageReference: C0603; Publisher: Altium Limited; Value: 47p-50V-5%; Digi-Key Part Number: 311-1021-1-ND; Unit Price: 0.00270
C14 C15 = Cap: CAP CER 27PF 50V 5% NPO 0402; Manufacturer: Yageo; Manufacturer Part Number: CC0402JRNPO9BN270; Description: CAP CER 47PF 50V 5% NPO 0402; Published: 8-Jun-2000; LatestRevisionDate: 17-Jul-2002; LatestRevisionNote: Re-released for DXP Platform.; PackageReference: C0603; Publisher: Altium Limited; Value: 27p-50V-5%; Digi-Key Part Number: 311-1019-2-ND; Unit Price: 0.00270
C17-C19 = Cap: CAP CER 47PF 50V 5% NPO 0402; Manufacturer: Yageo; Manufacturer Part Number: CC0402JRNPO9BN470; Published: 8-Jun-2000; LatestRevisionDate: 17-Jul-2002; LatestRevisionNote: Re-released for DXP Platform.; PackageReference: C0603; Publisher: Altium Limited; Value: 47p-50V-5%; Digi-Key Part Number: 311-1021-1-ND; Unit Price: 0.00270
E2 = Header 5: Header, 5-Pin; LatestRevisionDate: 17-Jul-2002; LatestRevisionNote: Re-released for DXP Platform.; Publisher: Altium Limited
J4 J5 = Socket: LatestRevisionDate: 17-Jul-2002; LatestRevisionNote: Re-released for DXP Platform.; Publisher: Altium Limited
L2 = Inductor: INDUCTOR 12NH 300MA 0402; Manufacturer: Murata Electronics North America; Manufacturer Part Number: LQG15HS12NJ02D; Code_IEC: 1005; Published: 8-Jun-2000; LatestRevisionDate: 29-May-2009; LatestRevisionNote: IPC-7351 Footprint Added.; PackageReference: 0402-A; Publisher: Altium Limited; PackageDescription: Chip Inductor; Code_JEITA: 0402; Value: 12nH-5%; Digi-Key Part Number: 490-2624-2-ND; Unit Price: 0.01872
P2 = Header 2: Header, 2-Pin; LatestRevisionDate: 17-Jul-2002; LatestRevisionNote: Re-released for DXP Platform.; Publisher: Altium Limited
P3 = SIM CARD: SIM _CONNECTOR_410108105011-2LF; Manufacturer: Tyrone
P22 = Header 3: GPS Antena; LatestRevisionDate: 17-Jul-2002; LatestRevisionNote: Re-released for DXP Platform.; Publisher: Altium Limited; Unit Price: 0.25; Remark: NA
R1 R2 = Res1: as R9 on sheet Main; Published: 8-Jun-2000; LatestRevisionDate: 17-Jul-2002; LatestRevisionNote: Re-released for DXP Platform.; PackageReference: R0603; Publisher: Altium Limited; Value: 4k7-5%; Digi-Key Part Number: 311-4.7KJRCT-ND; Unit Price: 0.00178
R3 R4 = Res1: as R11 on sheet Main; Published: 8-Jun-2000; LatestRevisionDate: 17-Jul-2002; LatestRevisionNote: Re-released for DXP Platform.; PackageReference: R0603; Publisher: Altium Limited; Value: 10k-5%; Digi-Key Part Number: 311-10KJRCT-ND; Unit Price: 0.00178
U1 = GPS-GT1612
U2 = XC6209B332MRN_SOT-25: Manufacturer: Tyrone
U3 = ublox: Manufacturer: Tyrone

## Nets that join several sheets
3v3: Main (34 pins), PSU (C40.2 C41.1 R28.2 U9.5), GSM_GPS (R3.1 R4.1)
5V: Main (P4.1 R16.2), PSU (C42.2 R31.2 U8.4)
GND: Main (48 pins), PSU (11 pins), GSM_GPS (41 pins)
VGSM: Main (U7.6), PSU (C43.1 Q2.3 U9.1 U9.3), GSM_GPS (7 pins)
CHG_DIS: Main (U6.27), PSU (Q3.1 R31.1 R32.2)
CHGB: Main (U6.42), PSU (C38.2 R28.1 U8.1)
GPS_EN: Main (U6.44), GSM_GPS (U2.3)
GPS_PULSE: Main (U6.47), GSM_GPS (U1.3)
GPS_TXD: Main (U6.31), GSM_GPS (U1.20 U3.23)
GSM_DTR: Main (U6.8), GSM_GPS (U3.12)
GSM_POWER: Main (U6.30), GSM_GPS (R3.2 U3.19)
GSM_RI: Main (U6.45), GSM_GPS (U3.10)
GSM_RST: Main (U6.33), GSM_GPS (R4.2 U3.22)
GSM_RTS: Main (U6.35), GSM_GPS (U3.13)
MIC_BIAS: Main (C70.2), GSM_GPS (C14.2 P2.1 U3.44)
NetD5_2: Main (D5.2 Q1.3), PSU (D10.2 Q2.1 R29.1)
SPK_N: Main (R25.2), GSM_GPS (U3.39)
SPK_P: Main (R26.2), GSM_GPS (U3.38)
UART1_RX: Main (U6.36), GSM_GPS (U3.16)
UART1_TX: Main (U6.37), GSM_GPS (U3.15)